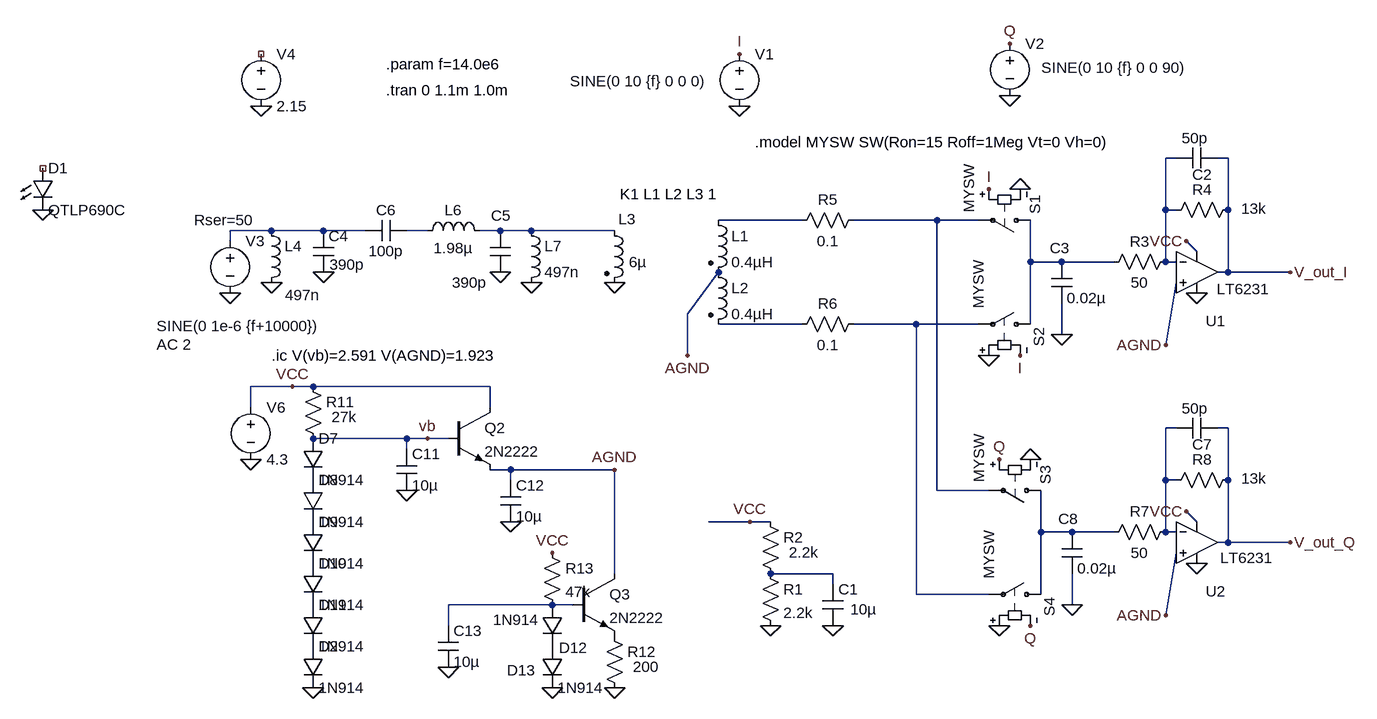
[diagram p0: schematic Tran_SDR_IQ.asc]
Tran_SDR_IQ.asc, the LTspice schematic file:
Version 4
SHEET 1 880 836
WIRE 320 -64 304 -64
WIRE 400 -64 384 -64
WIRE 304 16 304 -64
WIRE 320 16 304 16
WIRE 400 16 400 -64
WIRE -256 32 -384 32
WIRE -48 32 -176 32
WIRE 16 32 -48 32
WIRE -1072 48 -1136 48
WIRE -992 48 -1072 48
WIRE -928 48 -992 48
WIRE -832 48 -864 48
WIRE -720 48 -752 48
WIRE -672 48 -720 48
WIRE -544 48 -672 48
WIRE -1136 64 -1136 48
WIRE 352 80 336 64
WIRE 96 96 96 32
WIRE 144 96 96 96
WIRE 224 96 144 96
WIRE 304 96 304 16
WIRE 320 96 304 96
WIRE 400 112 400 16
WIRE 400 112 384 112
WIRE 496 112 400 112
WIRE -432 176 -384 112
WIRE -256 192 -384 192
WIRE -80 192 -176 192
WIRE 16 192 -80 192
WIRE 96 192 96 96
WIRE 144 208 144 160
WIRE 304 224 320 128
WIRE -432 240 -432 176
WIRE -1040 288 -1104 288
WIRE -1008 288 -1040 288
WIRE -736 288 -1008 288
WIRE -1104 320 -1104 288
WIRE -736 320 -736 288
WIRE 320 352 304 352
WIRE 400 352 384 352
WIRE -864 368 -1008 368
WIRE -832 368 -864 368
WIRE -800 368 -832 368
WIRE -864 384 -864 368
WIRE -704 416 -736 416
WIRE -544 416 -704 416
WIRE -704 432 -704 416
WIRE 304 432 304 352
WIRE 320 432 304 432
WIRE 400 432 400 352
WIRE -48 448 -48 32
WIRE 32 448 -48 448
WIRE -336 496 -400 496
WIRE -304 496 -336 496
WIRE 352 496 336 480
WIRE 112 512 112 448
WIRE 160 512 112 512
WIRE 224 512 160 512
WIRE 304 512 304 432
WIRE 320 512 304 512
WIRE 400 528 400 432
WIRE 400 528 384 528
WIRE 496 528 400 528
WIRE -544 576 -544 416
WIRE -208 576 -304 576
WIRE -208 592 -208 576
WIRE -80 608 -80 192
WIRE 32 608 -80 608
WIRE 112 608 112 512
WIRE -640 624 -800 624
WIRE -608 624 -640 624
WIRE 160 624 160 576
WIRE 304 640 320 544
WIRE -800 656 -800 624
FLAG -1136 144 0
FLAG -544 128 0
FLAG -304 656 0
FLAG -208 656 0
FLAG -352 -144 0
FLAG 80 -16 0
FLAG 32 240 0
FLAG 64 -160 0
FLAG 304 224 AGND
FLAG -432 240 AGND
FLAG -352 -224 I
FLAG 32 -16 I
FLAG 64 -240 Q
FLAG -336 496 VCC
FLAG 336 64 VCC
FLAG 352 144 0
FLAG 80 240 I
FLAG 144 208 0
FLAG 496 112 V_out_I
FLAG -1072 128 0
FLAG -992 112 0
FLAG -720 112 0
FLAG 96 400 0
FLAG 48 656 0
FLAG 304 640 AGND
FLAG 48 400 Q
FLAG 336 480 VCC
FLAG 352 560 0
FLAG 96 656 Q
FLAG 160 624 0
FLAG 496 528 V_out_Q
FLAG -672 128 0
FLAG -1088 -144 0
FLAG -1104 400 0
FLAG -1008 752 0
FLAG -864 448 0
FLAG -544 416 AGND
FLAG -1040 288 VCC
FLAG -704 496 0
FLAG -832 368 vb
FLAG -640 752 0
FLAG -544 752 0
FLAG -640 544 VCC
FLAG -800 720 0
FLAG -1424 16 0
SYMBOL Opamps\\LT6231 352 112 R0
WINDOW 0 14 75 Left 2
WINDOW 3 31 26 Left 2
SYMATTR InstName U1
SYMBOL sw 112 32 R90
WINDOW 0 -39 9 Left 2
WINDOW 3 -86 111 Left 2
SYMATTR InstName S1
SYMATTR Value MYSW
SYMBOL sw 112 192 M270
WINDOW 0 -34 3 Left 2
SYMATTR InstName S2
SYMATTR Value MYSW
SYMBOL voltage -352 -240 R0
WINDOW 123 0 0 Left 0
WINDOW 39 0 0 Left 0
WINDOW 3 -261 58 Left 2
SYMATTR Value SINE(0 10 {f} 0 0 0)
SYMATTR InstName V1
SYMBOL voltage 64 -256 R0
WINDOW 123 0 0 Left 0
WINDOW 39 0 0 Left 0
WINDOW 3 49 53 Left 2
SYMATTR Value SINE(0 10 {f} 0 0 90)
SYMATTR InstName V2
SYMBOL voltage -1136 48 R0
WINDOW 123 -113 175 Left 2
WINDOW 39 -55 -16 Left 2
WINDOW 3 -113 147 Left 2
SYMATTR Value2 AC 2
SYMATTR SpiceLine Rser=50
SYMATTR Value SINE(0 1e-6 {f+10000})
SYMATTR InstName V3
SYMBOL ind2 -400 16 R0
SYMATTR InstName L1
SYMATTR Value 0.4µH
SYMATTR Type ind
SYMBOL ind2 -400 96 R0
SYMATTR InstName L2
SYMATTR Value 0.4µH
SYMATTR Type ind
SYMBOL ind2 -560 32 R0
WINDOW 0 22 -2 Left 2
WINDOW 3 38 64 Left 2
SYMATTR InstName L3
SYMATTR Value 6µ
SYMATTR Type ind
SYMBOL res -320 560 R0
SYMATTR InstName R1
SYMATTR Value 2.2k
SYMBOL res -320 480 R0
WINDOW 3 44 63 Left 2
SYMATTR Value 2.2k
SYMATTR InstName R2
SYMBOL cap -224 592 R0
WINDOW 3 43 39 Left 2
SYMATTR Value 10µ
SYMATTR InstName C1
SYMBOL res 320 80 R90
WINDOW 0 0 56 VBottom 2
WINDOW 3 32 56 VTop 2
SYMATTR InstName R3
SYMATTR Value 50
SYMBOL res 416 0 R90
WINDOW 0 0 56 VBottom 2
WINDOW 3 -2 -24 VTop 2
SYMATTR InstName R4
SYMATTR Value 13k
SYMBOL cap 384 -80 R90
WINDOW 0 57 24 VBottom 2
WINDOW 3 -30 35 VTop 2
SYMATTR InstName C2
SYMATTR Value 50p
SYMBOL cap 128 96 R0
WINDOW 0 -2 -21 Left 2
SYMATTR InstName C3
SYMATTR Value 0.02µ
SYMBOL cap -1008 48 R0
WINDOW 3 25 52 Left 2
SYMATTR Value 390p
SYMATTR InstName C4
SYMBOL cap -736 48 R0
WINDOW 0 2 -23 Left 2
WINDOW 3 -58 80 Left 2
SYMATTR InstName C5
SYMATTR Value 390p
SYMBOL cap -864 32 R90
WINDOW 0 0 32 VBottom 2
WINDOW 3 32 32 VTop 2
SYMATTR InstName C6
SYMATTR Value 100p
SYMBOL ind -1088 32 R0
WINDOW 3 37 115 Left 2
SYMATTR Value 497n
SYMATTR InstName L4
SYMBOL ind -848 64 R270
WINDOW 0 32 56 VTop 2
WINDOW 3 5 56 VBottom 2
SYMATTR InstName L6
SYMATTR Value 1.98µ
SYMBOL Opamps\\LT6231 352 528 R0
WINDOW 0 14 75 Left 2
WINDOW 3 36 24 Left 2
SYMATTR InstName U2
SYMBOL sw 128 448 R90
WINDOW 0 -39 9 Left 2
WINDOW 3 -86 111 Left 2
SYMATTR InstName S3
SYMATTR Value MYSW
SYMBOL sw 128 608 M270
WINDOW 0 -34 3 Left 2
SYMATTR InstName S4
SYMATTR Value MYSW
SYMBOL res 320 496 R90
WINDOW 0 0 56 VBottom 2
WINDOW 3 32 56 VTop 2
SYMATTR InstName R7
SYMATTR Value 50
SYMBOL res 416 416 R90
WINDOW 0 0 56 VBottom 2
WINDOW 3 -2 -24 VTop 2
SYMATTR InstName R8
SYMATTR Value 13k
SYMBOL cap 384 336 R90
WINDOW 0 57 24 VBottom 2
WINDOW 3 -30 35 VTop 2
SYMATTR InstName C7
SYMATTR Value 50p
SYMBOL cap 144 512 R0
WINDOW 0 -5 -20 Left 2
SYMATTR InstName C8
SYMATTR Value 0.02µ
SYMBOL res -160 16 R90
WINDOW 0 0 56 VBottom 2
WINDOW 3 32 56 VTop 2
SYMATTR InstName R5
SYMATTR Value 0.1
SYMBOL res -160 176 R90
WINDOW 0 0 56 VBottom 2
WINDOW 3 32 56 VTop 2
SYMATTR InstName R6
SYMATTR Value 0.1
SYMBOL ind -688 32 R0
SYMATTR InstName L7
SYMATTR Value 497n
SYMBOL LED -1440 -48 R0
SYMATTR InstName D1
SYMATTR Value QTLP690C
SYMBOL voltage -1088 -240 R0
SYMATTR InstName V4
SYMATTR Value 2.15
SYMBOL res -1024 272 R0
WINDOW 3 44 63 Left 2
SYMATTR Value 27k
SYMATTR InstName R11
SYMBOL cap -880 384 R0
SYMATTR InstName C11
SYMATTR Value 10µ
SYMBOL voltage -1104 304 R0
WINDOW 123 0 0 Left 0
WINDOW 39 0 0 Left 0
SYMATTR InstName V6
SYMATTR Value 4.3
SYMBOL npn -800 320 R0
SYMATTR InstName Q2
SYMATTR Value 2N2222
SYMBOL cap -720 432 R0
SYMATTR InstName C12
SYMATTR Value 10µ
SYMBOL diode -1024 368 R0
SYMATTR InstName D7
SYMATTR Value 1N914
SYMBOL diode -1024 432 R0
SYMATTR InstName D8
SYMATTR Value 1N914
SYMBOL diode -1024 496 R0
SYMATTR InstName D9
SYMATTR Value 1N914
SYMBOL diode -1024 560 R0
SYMATTR InstName D10
SYMATTR Value 1N914
SYMBOL diode -1024 624 R0
SYMATTR InstName D11
SYMATTR Value 1N914
SYMBOL npn -608 576 R0
SYMATTR InstName Q3
SYMATTR Value 2N2222
SYMBOL res -560 656 R0
WINDOW 3 44 63 Left 2
SYMATTR Value 200
SYMATTR InstName R12
SYMBOL res -656 528 R0
SYMATTR InstName R13
SYMATTR Value 47k
SYMBOL diode -656 624 R0
WINDOW 0 26 66 Left 2
WINDOW 3 -75 23 Left 2
SYMATTR InstName D12
SYMATTR Value 1N914
SYMBOL diode -656 688 R0
WINDOW 0 -54 37 Left 2
SYMATTR InstName D13
SYMATTR Value 1N914
SYMBOL cap -816 656 R0
SYMATTR InstName C13
SYMATTR Value 10µ
SYMBOL diode -1024 688 R0
SYMATTR InstName D2
SYMATTR Value 1N914
TEXT -896 -168 Left 2 !.tran 0 1.1m 1.0m
TEXT -328 -88 Left 2 !.model MYSW SW(Ron=15 Roff=1Meg Vt=0 Vh=0)
TEXT -536 -8 Left 2 !K1 L1 L2 L3 1
TEXT -896 -208 Left 2 !.param f=14.0e6
TEXT -1072 240 Left 2 !.ic V(vb)=2.591 V(AGND)=1.923

The netlist it stands for:
* Tran_SDR_IQ.asc
XU1 AGND N001 V_out_I VCC 0 LT6231  ; pins In+ In- OUT V+ V-
S1 N007 N003 I 0 MYSW
S2 N007 N009 0 I MYSW
V1 I 0 SINE(0 10 {f} 0 0 0)
V2 Q 0 SINE(0 10 {f} 0 0 90)
V3 N004 0 SINE(0 1e-6 {f+10000}) AC 2 Rser=50
L1 N002 AGND 0.4µH
L2 AGND N008 0.4µH
L3 N006 0 6µ
R1 N012 0 2.2k
R2 VCC N012 2.2k
C1 N012 0 10µ
R3 N001 N007 50
R4 V_out_I N001 13k
C2 V_out_I N001 50p
C3 N007 0 0.02µ
C4 N004 0 390p
C5 N006 0 390p
C6 N005 N004 100p
L4 N004 0 497n
L6 N005 N006 1.98µ
XU2 AGND N010 V_out_Q VCC 0 LT6231  ; pins In+ In- OUT V+ V-
S3 N011 N003 Q 0 MYSW
S4 N011 N009 0 Q MYSW
R7 N010 N011 50
R8 V_out_Q N010 13k
C7 V_out_Q N010 50p
C8 N011 0 0.02µ
R5 N003 N002 0.1
R6 N009 N008 0.1
L7 N006 0 497n
D1 NC_01 0 QTLP690C
V4 NC_02 0 2.15
R11 VCC vb 27k
C11 vb 0 10µ
V6 VCC 0 4.3
Q2 VCC vb AGND 0 2N2222
C12 AGND 0 10µ
D7 vb P001 1N914
D8 P001 P002 1N914
D9 P002 P003 1N914
D10 P003 P004 1N914
D11 P004 P005 1N914
Q3 AGND N013 P006 0 2N2222
R12 P006 0 200
R13 VCC N013 47k
D12 N013 P007 1N914
D13 P007 0 1N914
C13 N013 0 10µ
D2 P005 0 1N914
.model D D
.lib standard.dio
.model NPN NPN
.model PNP PNP
.lib standard.bjt
.tran 0 1.1m 1.0m
.model MYSW SW(Ron=15 Roff=1Meg Vt=0 Vh=0)
K1 L1 L2 L3 1
.param f=14.0e6
.ic V(vb)=2.591 V(AGND)=1.923
.lib LTC2.lib
.backanno
.end